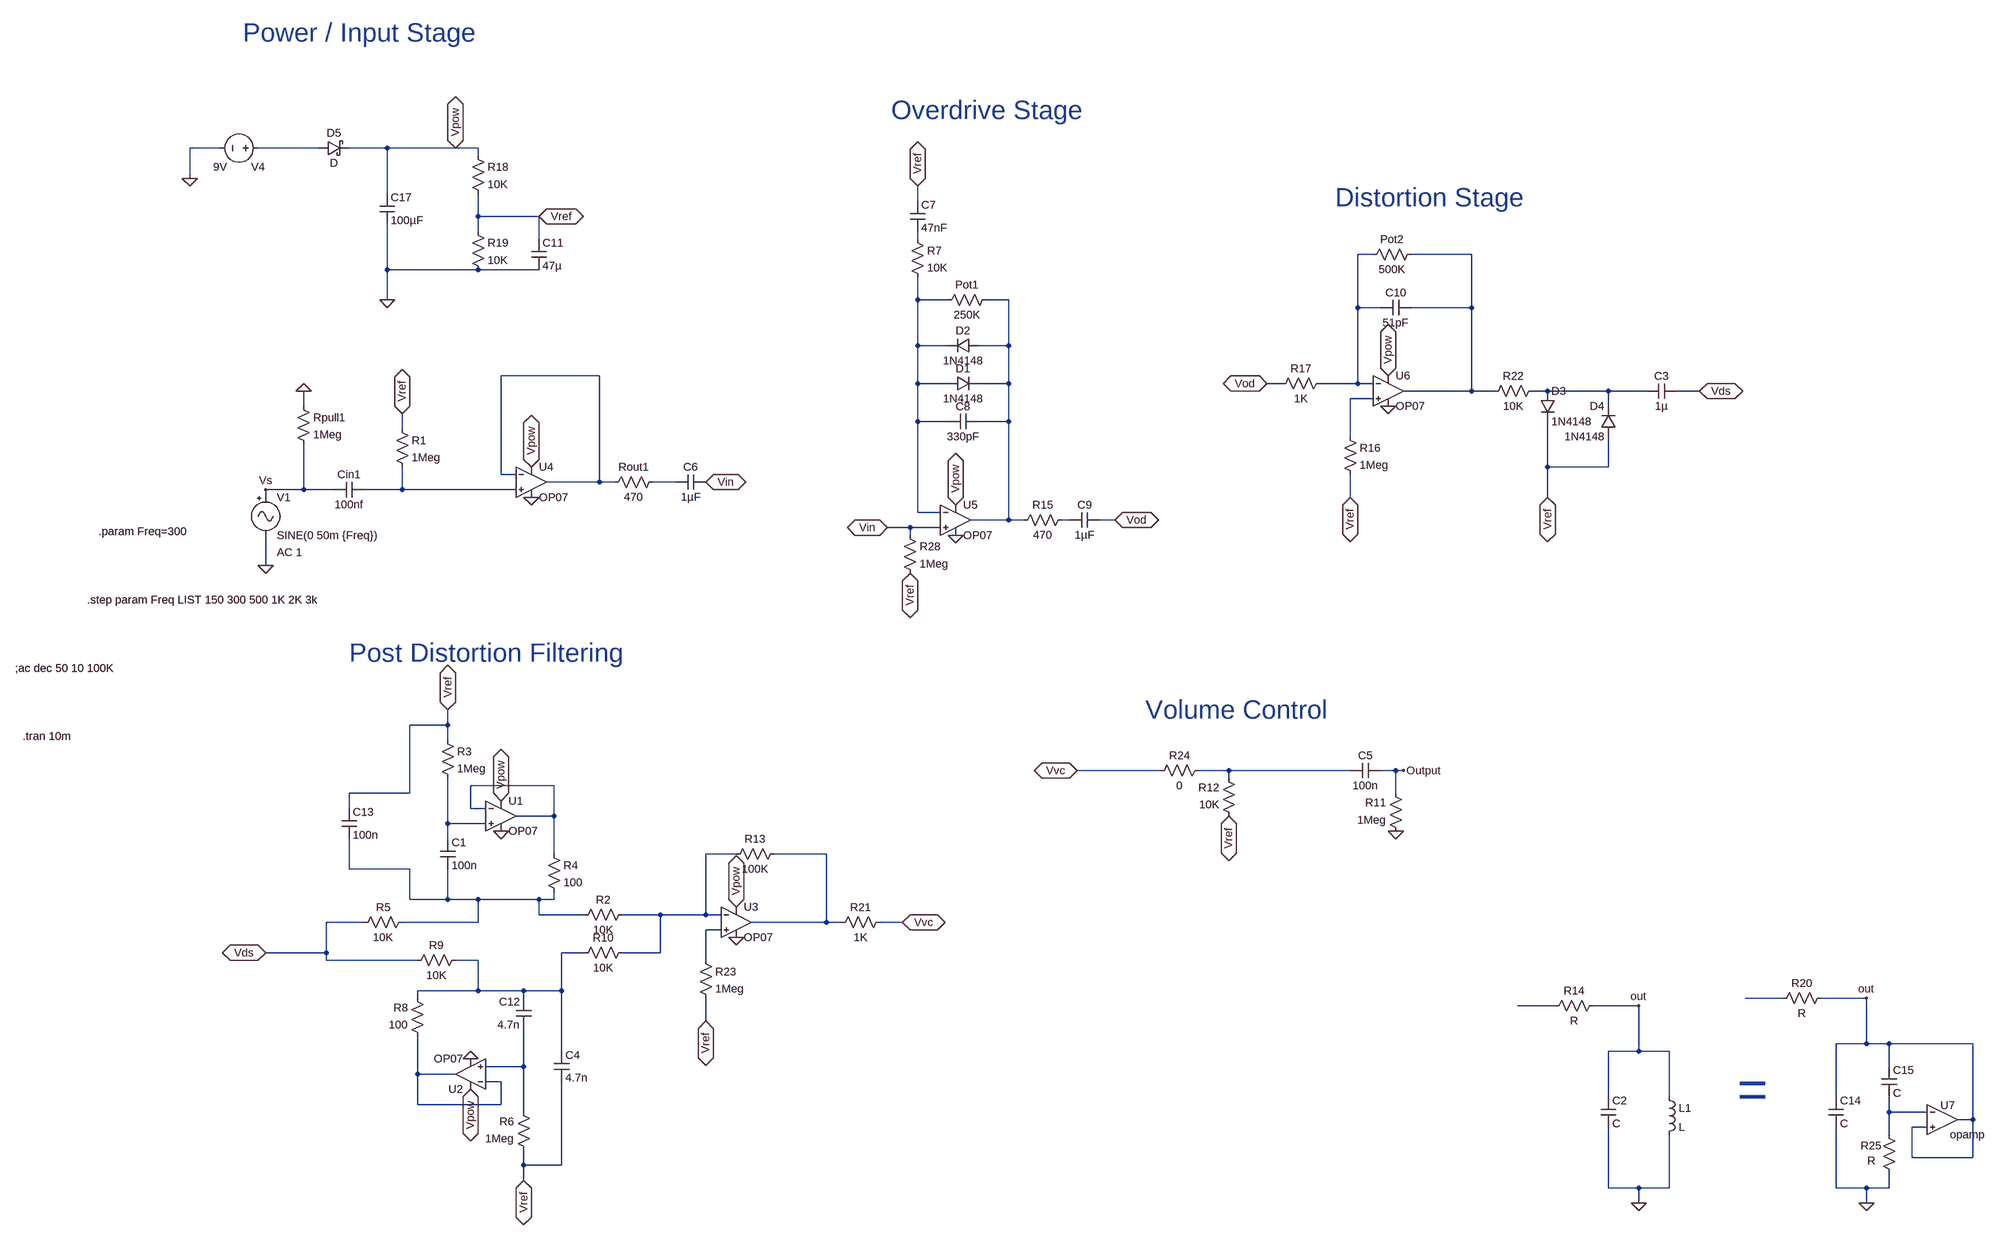
[diagram p0: schematic Draft2.asc]
Draft2.asc, the LTspice schematic file:
Version 4
SHEET 1 6272 3036
WIRE 384 592 320 592
WIRE 592 592 464 592
WIRE 736 592 656 592
WIRE 880 592 736 592
WIRE 928 592 880 592
WIRE 928 608 928 592
WIRE 320 656 320 592
WIRE 736 688 736 592
WIRE 1856 704 1856 672
WIRE 928 736 928 688
WIRE 1056 736 928 736
WIRE 928 768 928 736
WIRE 1056 784 1056 736
WIRE 1856 784 1856 768
WIRE 2816 816 2784 816
WIRE 3024 816 2896 816
WIRE 736 848 736 752
WIRE 928 848 736 848
WIRE 1056 848 928 848
WIRE 736 912 736 848
WIRE 1856 912 1856 864
WIRE 1920 912 1856 912
WIRE 2048 912 2000 912
WIRE 2784 928 2784 816
WIRE 2832 928 2784 928
WIRE 3024 928 3024 816
WIRE 3024 928 2896 928
WIRE 1856 1008 1856 912
WIRE 1920 1008 1856 1008
WIRE 2048 1008 2048 912
WIRE 2048 1008 1984 1008
WIRE 1184 1072 976 1072
WIRE 1856 1088 1856 1008
WIRE 1920 1088 1856 1088
WIRE 2048 1088 2048 1008
WIRE 2048 1088 1984 1088
WIRE 2624 1088 2592 1088
WIRE 2784 1088 2784 928
WIRE 2784 1088 2704 1088
WIRE 2816 1088 2784 1088
WIRE 3024 1104 3024 928
WIRE 3024 1104 2880 1104
WIRE 3072 1104 3024 1104
WIRE 3184 1104 3152 1104
WIRE 3312 1104 3184 1104
WIRE 3392 1104 3312 1104
WIRE 3504 1104 3456 1104
WIRE 2816 1120 2768 1120
WIRE 560 1136 560 1104
WIRE 3312 1136 3312 1104
WIRE 1856 1168 1856 1088
WIRE 1920 1168 1856 1168
WIRE 2048 1168 2048 1088
WIRE 2048 1168 1984 1168
WIRE 768 1184 768 1152
WIRE 2768 1200 2768 1120
WIRE 3184 1264 3184 1168
WIRE 3312 1264 3312 1200
WIRE 3312 1264 3184 1264
WIRE 976 1280 976 1072
WIRE 1008 1280 976 1280
WIRE 1184 1296 1184 1072
WIRE 1184 1296 1072 1296
WIRE 1216 1296 1184 1296
WIRE 1344 1296 1296 1296
WIRE 560 1312 560 1216
WIRE 560 1312 480 1312
WIRE 624 1312 560 1312
WIRE 768 1312 768 1264
WIRE 768 1312 688 1312
WIRE 1008 1312 768 1312
WIRE 480 1328 480 1312
WIRE 2768 1328 2768 1280
WIRE 3184 1328 3184 1264
WIRE 1856 1360 1856 1168
WIRE 1904 1360 1856 1360
WIRE 2048 1376 2048 1168
WIRE 2048 1376 1968 1376
WIRE 2080 1376 2048 1376
WIRE 2176 1376 2160 1376
WIRE 2272 1376 2240 1376
WIRE 1840 1392 1792 1392
WIRE 1904 1392 1840 1392
WIRE 1840 1408 1840 1392
WIRE 480 1472 480 1408
WIRE 864 1808 864 1776
WIRE 864 1808 784 1808
WIRE 864 1840 864 1808
WIRE 2368 1904 2192 1904
WIRE 2512 1904 2448 1904
WIRE 2768 1904 2512 1904
WIRE 2864 1904 2832 1904
WIRE 2880 1904 2864 1904
WIRE 2512 1920 2512 1904
WIRE 1088 1936 912 1936
WIRE 784 1952 784 1808
WIRE 784 1952 656 1952
WIRE 2864 1952 2864 1904
WIRE 656 1984 656 1952
WIRE 912 1984 912 1936
WIRE 944 1984 912 1984
WIRE 1088 2000 1088 1936
WIRE 1088 2000 1008 2000
WIRE 864 2016 864 1920
WIRE 944 2016 864 2016
WIRE 864 2048 864 2016
WIRE 1088 2080 1088 2000
WIRE 1472 2080 1408 2080
WIRE 1664 2080 1552 2080
WIRE 656 2112 656 2048
WIRE 784 2112 656 2112
WIRE 784 2176 784 2112
WIRE 864 2176 864 2112
WIRE 864 2176 784 2176
WIRE 928 2176 864 2176
WIRE 1056 2176 928 2176
WIRE 1088 2176 1088 2160
WIRE 1088 2176 1056 2176
WIRE 1056 2208 1056 2176
WIRE 1152 2208 1056 2208
WIRE 1312 2208 1232 2208
WIRE 1408 2208 1408 2080
WIRE 1408 2208 1312 2208
WIRE 1440 2208 1408 2208
WIRE 688 2224 608 2224
WIRE 928 2224 928 2176
WIRE 928 2224 768 2224
WIRE 1664 2224 1664 2080
WIRE 1664 2224 1504 2224
WIRE 1696 2224 1664 2224
WIRE 1824 2224 1776 2224
WIRE 1440 2240 1408 2240
WIRE 608 2288 608 2224
WIRE 608 2288 480 2288
WIRE 1152 2288 1104 2288
WIRE 1312 2288 1312 2208
WIRE 1312 2288 1232 2288
WIRE 608 2304 608 2288
WIRE 800 2304 608 2304
WIRE 928 2304 880 2304
WIRE 1408 2304 1408 2240
WIRE 928 2368 928 2304
WIRE 928 2368 800 2368
WIRE 1024 2368 928 2368
WIRE 1104 2368 1104 2288
WIRE 1104 2368 1024 2368
WIRE 800 2384 800 2368
WIRE 1024 2384 1024 2368
WIRE 3680 2384 3600 2384
WIRE 3856 2384 3760 2384
WIRE 3200 2400 3120 2400
WIRE 3376 2400 3280 2400
WIRE 1408 2432 1408 2384
WIRE 3856 2480 3856 2384
WIRE 3856 2480 3792 2480
WIRE 3904 2480 3856 2480
WIRE 4080 2480 3904 2480
WIRE 1104 2496 1104 2368
WIRE 3376 2496 3376 2400
WIRE 3376 2496 3312 2496
WIRE 3440 2496 3376 2496
WIRE 1024 2528 1024 2448
WIRE 1024 2528 944 2528
WIRE 3904 2528 3904 2480
WIRE 800 2544 800 2464
WIRE 880 2544 800 2544
WIRE 976 2560 944 2560
WIRE 3312 2592 3312 2496
WIRE 3440 2592 3440 2496
WIRE 3792 2592 3792 2480
WIRE 800 2608 800 2544
WIRE 976 2608 976 2560
WIRE 976 2608 800 2608
WIRE 1024 2624 1024 2528
WIRE 3904 2624 3904 2592
WIRE 3984 2624 3904 2624
WIRE 4080 2640 4080 2480
WIRE 4080 2640 4048 2640
WIRE 3984 2656 3952 2656
WIRE 3904 2672 3904 2624
WIRE 3952 2720 3952 2656
WIRE 4080 2720 4080 2640
WIRE 4080 2720 3952 2720
WIRE 1024 2736 1024 2704
WIRE 1104 2736 1104 2560
WIRE 1104 2736 1024 2736
WIRE 1024 2768 1024 2736
WIRE 3312 2784 3312 2656
WIRE 3376 2784 3312 2784
WIRE 3440 2784 3440 2672
WIRE 3440 2784 3376 2784
WIRE 3792 2784 3792 2656
WIRE 3856 2784 3792 2784
WIRE 3904 2784 3904 2752
WIRE 3904 2784 3856 2784
WIRE 3376 2816 3376 2784
WIRE 3856 2816 3856 2784
FLAG 480 1472 0
FLAG 560 1104 0
FLAG 320 656 0
FLAG 768 1152 Vref
IOPIN 768 1152 BiDir
FLAG 1040 1264 Vpow
IOPIN 1040 1264 BiDir
FLAG 1936 1344 Vpow
IOPIN 1936 1344 BiDir
FLAG 2848 1072 Vpow
IOPIN 2848 1072 BiDir
FLAG 1040 1328 0
FLAG 1936 1408 0
FLAG 2848 1136 0
FLAG 1856 672 Vref
IOPIN 1856 672 BiDir
FLAG 2768 1328 Vref
IOPIN 2768 1328 BiDir
FLAG 3184 1328 Vref
IOPIN 3184 1328 BiDir
FLAG 480 1312 Vs
FLAG 1408 1296 Vin
IOPIN 1408 1296 BiDir
FLAG 736 912 0
FLAG 880 592 Vpow
IOPIN 880 592 BiDir
FLAG 1056 736 Vref
IOPIN 1056 736 BiDir
FLAG 1840 1488 Vref
IOPIN 1840 1488 BiDir
FLAG 2512 2000 Vref
IOPIN 2512 2000 BiDir
FLAG 976 2032 0
FLAG 912 2512 0
FLAG 1472 2256 0
FLAG 864 1776 Vref
IOPIN 864 1776 BiDir
FLAG 1024 2768 Vref
IOPIN 1024 2768 BiDir
FLAG 480 2288 Vds
IOPIN 480 2288 BiDir
FLAG 912 2576 Vpow
IOPIN 912 2576 BiDir
FLAG 976 1968 Vpow
IOPIN 976 1968 BiDir
FLAG 1472 2192 Vpow
IOPIN 1472 2192 BiDir
FLAG 1408 2432 Vref
IOPIN 1408 2432 BiDir
FLAG 2880 1904 Output
FLAG 1824 2224 Vvc
IOPIN 1824 2224 BiDir
FLAG 2592 1088 Vod
IOPIN 2592 1088 BiDir
FLAG 1792 1392 Vin
IOPIN 1792 1392 BiDir
FLAG 2272 1376 Vod
IOPIN 2272 1376 BiDir
FLAG 3504 1104 Vds
IOPIN 3504 1104 BiDir
FLAG 2192 1904 Vvc
IOPIN 2192 1904 BiDir
FLAG 2864 2032 0
FLAG 3376 2816 0
FLAG 3376 2400 out
FLAG 3856 2816 0
FLAG 3856 2384 out
SYMBOL OpAmps\\OP07 1040 1232 R0
SYMATTR InstName U4
SYMBOL Misc\\signal 480 1312 R0
WINDOW 123 24 132 Left 2
WINDOW 39 0 0 Left 0
SYMATTR Value2 AC 1
SYMATTR InstName V1
SYMATTR Value SINE(0 50m {Freq})
SYMBOL cap 688 1296 R90
WINDOW 0 0 32 VBottom 2
WINDOW 3 32 32 VTop 2
SYMATTR InstName Cin1
SYMATTR Value 100nf
SYMBOL res 752 1168 R0
SYMATTR InstName R1
SYMATTR Value 1Meg
SYMBOL res 1312 1280 R90
WINDOW 0 0 56 VBottom 2
WINDOW 3 32 56 VTop 2
SYMATTR InstName Rout1
SYMATTR Value 470
SYMBOL cap 1408 1280 R90
WINDOW 0 0 32 VBottom 2
WINDOW 3 32 32 VTop 2
SYMATTR InstName C6
SYMATTR Value 1µF
SYMBOL OpAmps\\OP07 1936 1312 R0
SYMATTR InstName U5
SYMBOL res 2016 896 R90
WINDOW 0 0 56 VBottom 2
WINDOW 3 32 56 VTop 2
SYMATTR InstName Pot1
SYMATTR Value 250K
SYMBOL res 1840 768 R0
SYMATTR InstName R7
SYMATTR Value 10K
SYMBOL diode 1920 1104 R270
WINDOW 0 32 32 VTop 2
WINDOW 3 0 32 VBottom 2
SYMATTR InstName D1
SYMATTR Value 1N4148
SYMBOL diode 1984 992 R90
WINDOW 0 0 32 VBottom 2
WINDOW 3 32 32 VTop 2
SYMATTR InstName D2
SYMATTR Value 1N4148
SYMBOL cap 1840 704 R0
SYMATTR InstName C7
SYMATTR Value 47nF
SYMBOL cap 1984 1152 R90
WINDOW 0 0 32 VBottom 2
WINDOW 3 32 32 VTop 2
SYMATTR InstName C8
SYMATTR Value 330pF
SYMBOL OpAmps\\OP07 2848 1040 R0
SYMATTR InstName U6
SYMBOL cap 2240 1360 R90
WINDOW 0 0 32 VBottom 2
WINDOW 3 32 32 VTop 2
SYMATTR InstName C9
SYMATTR Value 1µF
SYMBOL cap 2896 912 R90
WINDOW 0 0 32 VBottom 2
WINDOW 3 32 32 VTop 2
SYMATTR InstName C10
SYMATTR Value 51pF
SYMBOL res 2912 800 R90
WINDOW 0 0 56 VBottom 2
WINDOW 3 32 56 VTop 2
SYMATTR InstName Pot2
SYMATTR Value 500K
SYMBOL diode 3168 1104 R0
SYMATTR InstName D3
SYMATTR Value 1N4148
SYMBOL diode 3328 1200 R180
WINDOW 0 24 64 Left 2
WINDOW 3 24 0 Left 2
SYMATTR InstName D4
SYMATTR Value 1N4148
SYMBOL res 2176 1360 R90
WINDOW 0 0 56 VBottom 2
WINDOW 3 32 56 VTop 2
SYMATTR InstName R15
SYMATTR Value 470
SYMBOL res 2752 1184 R0
SYMATTR InstName R16
SYMATTR Value 1Meg
SYMBOL res 544 1120 R0
SYMATTR InstName Rpull1
SYMATTR Value 1Meg
SYMBOL res 2720 1072 R90
WINDOW 0 0 56 VBottom 2
WINDOW 3 32 56 VTop 2
SYMATTR InstName R17
SYMATTR Value 1K
SYMBOL voltage 480 592 R90
WINDOW 123 0 0 Left 0
WINDOW 39 0 0 Left 0
WINDOW 0 40 1 VRight 2
WINDOW 3 40 81 VRight 2
SYMATTR InstName V4
SYMATTR Value 9V
SYMBOL res 912 592 R0
SYMATTR InstName R18
SYMATTR Value 10K
SYMBOL res 912 752 R0
SYMATTR InstName R19
SYMATTR Value 10K
SYMBOL cap 1040 784 R0
SYMATTR InstName C11
SYMATTR Value 47µ
SYMBOL res 3168 1088 R90
WINDOW 0 0 56 VBottom 2
WINDOW 3 32 56 VTop 2
SYMATTR InstName R22
SYMATTR Value 10K
SYMBOL res 2464 1888 R90
WINDOW 0 0 56 VBottom 2
WINDOW 3 32 56 VTop 2
SYMATTR InstName R24
SYMATTR Value 0
SYMBOL cap 720 688 R0
SYMATTR InstName C17
SYMATTR Value 100µF
SYMBOL schottky 592 608 R270
WINDOW 0 32 32 VTop 2
WINDOW 3 0 32 VBottom 2
SYMATTR InstName D5
SYMBOL res 1824 1392 R0
SYMATTR InstName R28
SYMATTR Value 1Meg
SYMBOL OpAmps\\OP07 976 1936 R0
SYMATTR InstName U1
SYMBOL res 848 1824 R0
SYMATTR InstName R3
SYMATTR Value 1Meg
SYMBOL cap 848 2048 R0
SYMATTR InstName C1
SYMATTR Value 100n
SYMBOL res 1072 2064 R0
SYMATTR InstName R4
SYMATTR Value 100
SYMBOL OpAmps\\OP07 912 2608 R180
SYMATTR InstName U2
SYMBOL res 1040 2720 R180
WINDOW 0 36 76 Left 2
WINDOW 3 36 40 Left 2
SYMATTR InstName R6
SYMATTR Value 1Meg
SYMBOL res 816 2480 R180
WINDOW 0 36 76 Left 2
WINDOW 3 36 40 Left 2
SYMATTR InstName R8
SYMATTR Value 100
SYMBOL cap 1088 2496 R0
SYMATTR InstName C4
SYMATTR Value 4.7n
SYMBOL OpAmps\\OP07 1472 2160 R0
SYMATTR InstName U3
SYMBOL res 1568 2064 R90
WINDOW 0 0 56 VBottom 2
WINDOW 3 32 56 VTop 2
SYMATTR InstName R13
SYMATTR Value 100K
SYMBOL res 1792 2208 R90
WINDOW 0 0 56 VBottom 2
WINDOW 3 32 56 VTop 2
SYMATTR InstName R21
SYMATTR Value 1K
SYMBOL res 1392 2288 R0
SYMATTR InstName R23
SYMATTR Value 1Meg
SYMBOL cap 2832 1888 R90
WINDOW 0 0 32 VBottom 2
WINDOW 3 32 32 VTop 2
SYMATTR InstName C5
SYMATTR Value 100n
SYMBOL res 1248 2192 R90
WINDOW 0 0 56 VBottom 2
WINDOW 3 32 56 VTop 2
SYMATTR InstName R2
SYMATTR Value 10K
SYMBOL res 1248 2272 R90
WINDOW 0 0 56 VBottom 2
WINDOW 3 32 56 VTop 2
SYMATTR InstName R10
SYMATTR Value 10K
SYMBOL cap 1040 2448 R180
WINDOW 0 24 56 Left 2
WINDOW 3 24 8 Left 2
SYMATTR InstName C12
SYMATTR Value 4.7n
SYMBOL cap 640 1984 R0
SYMATTR InstName C13
SYMATTR Value 100n
SYMBOL res 784 2208 R90
WINDOW 0 0 56 VBottom 2
WINDOW 3 32 56 VTop 2
SYMATTR InstName R5
SYMATTR Value 10K
SYMBOL res 896 2288 R90
WINDOW 0 0 56 VBottom 2
WINDOW 3 32 56 VTop 2
SYMATTR InstName R9
SYMATTR Value 10K
SYMBOL cap 3456 1088 R90
WINDOW 0 0 32 VBottom 2
WINDOW 3 32 32 VTop 2
SYMATTR InstName C3
SYMATTR Value 1µ
SYMBOL res 2528 2016 R180
WINDOW 0 36 76 Left 2
WINDOW 3 36 40 Left 2
SYMATTR InstName R12
SYMATTR Value 10K
SYMBOL res 2880 2048 R180
WINDOW 0 36 76 Left 2
WINDOW 3 36 40 Left 2
SYMATTR InstName R11
SYMATTR Value 1Meg
SYMBOL res 3296 2384 R90
WINDOW 0 0 56 VBottom 2
WINDOW 3 32 56 VTop 2
SYMATTR InstName R14
SYMBOL cap 3296 2592 R0
SYMATTR InstName C2
SYMBOL ind 3424 2576 R0
SYMATTR InstName L1
SYMBOL OpAmps\\opamp 4016 2576 R0
WINDOW 0 -4 34 Left 2
SYMATTR InstName U7
SYMBOL res 3776 2368 R90
WINDOW 0 0 56 VBottom 2
WINDOW 3 32 56 VTop 2
SYMATTR InstName R20
SYMBOL cap 3776 2592 R0
SYMATTR InstName C14
SYMBOL cap 3888 2528 R0
SYMATTR InstName C15
SYMBOL res 3888 2656 R0
WINDOW 0 -44 39 Left 2
WINDOW 3 -30 71 Left 2
SYMATTR InstName R25
TEXT 1800 512 Left 5 ;Overdrive Stage
TEXT 2736 696 Left 5 ;Distortion Stage
TEXT 656 1656 Left 5 ;Post Distortion Filtering
TEXT -48 1688 Left 2 !;ac dec 50 10 100K
TEXT 432 328 Left 5 ;Power / Input Stage
TEXT 2336 1776 Left 5 ;Volume Control
TEXT 128 1400 Left 2 !.param Freq=300
TEXT 104 1544 Left 2 !.step param Freq LIST 150 300 500 1K 2K 3k
TEXT -32 1832 Left 2 !.tran 10m
TEXT 3584 2576 Left 7 ;=

The netlist it stands for:
* Draft2.asc
XU4 N011 N007 Vpow 0 N007 LT1001  ; OP07, pins In+ In- V+ V- OUT
V1 Vs 0 SINE(0 50m {Freq}) AC 1
Cin1 N011 Vs 100nf
R1 Vref N011 1Meg
Rout1 N010 N007 470
C6 Vin N010 1µF
XU5 Vin N005 Vpow 0 N006 LT1001  ; OP07, pins In+ In- V+ V- OUT
R§Pot1 N006 N005 250K
R7 N002 N005 10K
D1 N005 N006 1N4148
D2 N006 N005 1N4148
C7 Vref N002 47nF
C8 N006 N005 330pF
XU6 N009 N003 Vpow 0 N004 LT1001  ; OP07, pins In+ In- V+ V- OUT
C9 Vod N012 1µF
C10 N004 N003 51pF
R§Pot2 N004 N003 500K
D3 N008 Vref 1N4148
D4 Vref N008 1N4148
R15 N012 N006 470
R16 N009 Vref 1Meg
Rpull1 0 Vs 1Meg
R17 N003 Vod 1K
V4 N001 0 9V
R18 Vpow Vref 10K
R19 Vref 0 10K
C11 Vref 0 47µ
R22 N008 N004 10K
R24 N013 Vvc 0
C17 Vpow 0 100µF
D5 N001 Vpow D
R28 Vin Vref 1Meg
XU1 N015 N014 Vpow 0 N014 LT1001  ; OP07, pins In+ In- V+ V- OUT
R3 Vref N015 1Meg
C1 N015 N018 100n
R4 N014 N018 100
XU2 N023 N024 Vpow 0 N024 LT1001  ; OP07, pins In+ In- V+ V- OUT
R6 Vref N023 1Meg
R8 N024 N020 100
C4 N020 Vref 4.7n
XU3 N019 N016 Vpow 0 N017 LT1001  ; OP07, pins In+ In- V+ V- OUT
R13 N017 N016 100K
R21 Vvc N017 1K
R23 N019 Vref 1Meg
C5 Output N013 100n
R2 N016 N018 10K
R10 N016 N020 10K
C12 N023 N020 4.7n
C13 Vref N018 100n
R5 N018 Vds 10K
R9 N020 Vds 10K
C3 Vds N008 1µ
R12 Vref N013 10K
R11 0 Output 1Meg
R14 out N022 R
C2 out 0 C
L1 out 0 L
XU7 N025 out out opamp Aol=100K GBW=10Meg  ; pins invin noninvin out
R20 out N021 R
C14 out 0 C
C15 out N025 C
R25 N025 0 R
.model D D
.lib standard.dio
* Overdrive Stage
* Distortion Stage
* Post Distortion Filtering
;ac dec 50 10 100K
* Power / Input Stage
* Volume Control
.param Freq=300
.step param Freq LIST 150 300 500 1K 2K 3k
.tran 10m
* =
.lib LTC.lib
.backanno
.end